# EasyEDA Pro project ProPrj_PCB-rocket-flight-controller_2026-04-01.epro, schematic rocket flight controller

## Sheets
1 Sheet_1: Board Name: rocket flight controller; Create Date: 2025-12-31; Page Name: Sheet_1; Project Name: PCB-rocket-flight-controller; Schematic Name: rocket flight controller; Update Date: 2026-01-02; Add into BOM: yes; Company: Your Company; Convert to PCB: yes; Date: 2025-05-15; Draw By: 2026iruf; REV: 1.0; Sheet: 1/1; spicePre: .
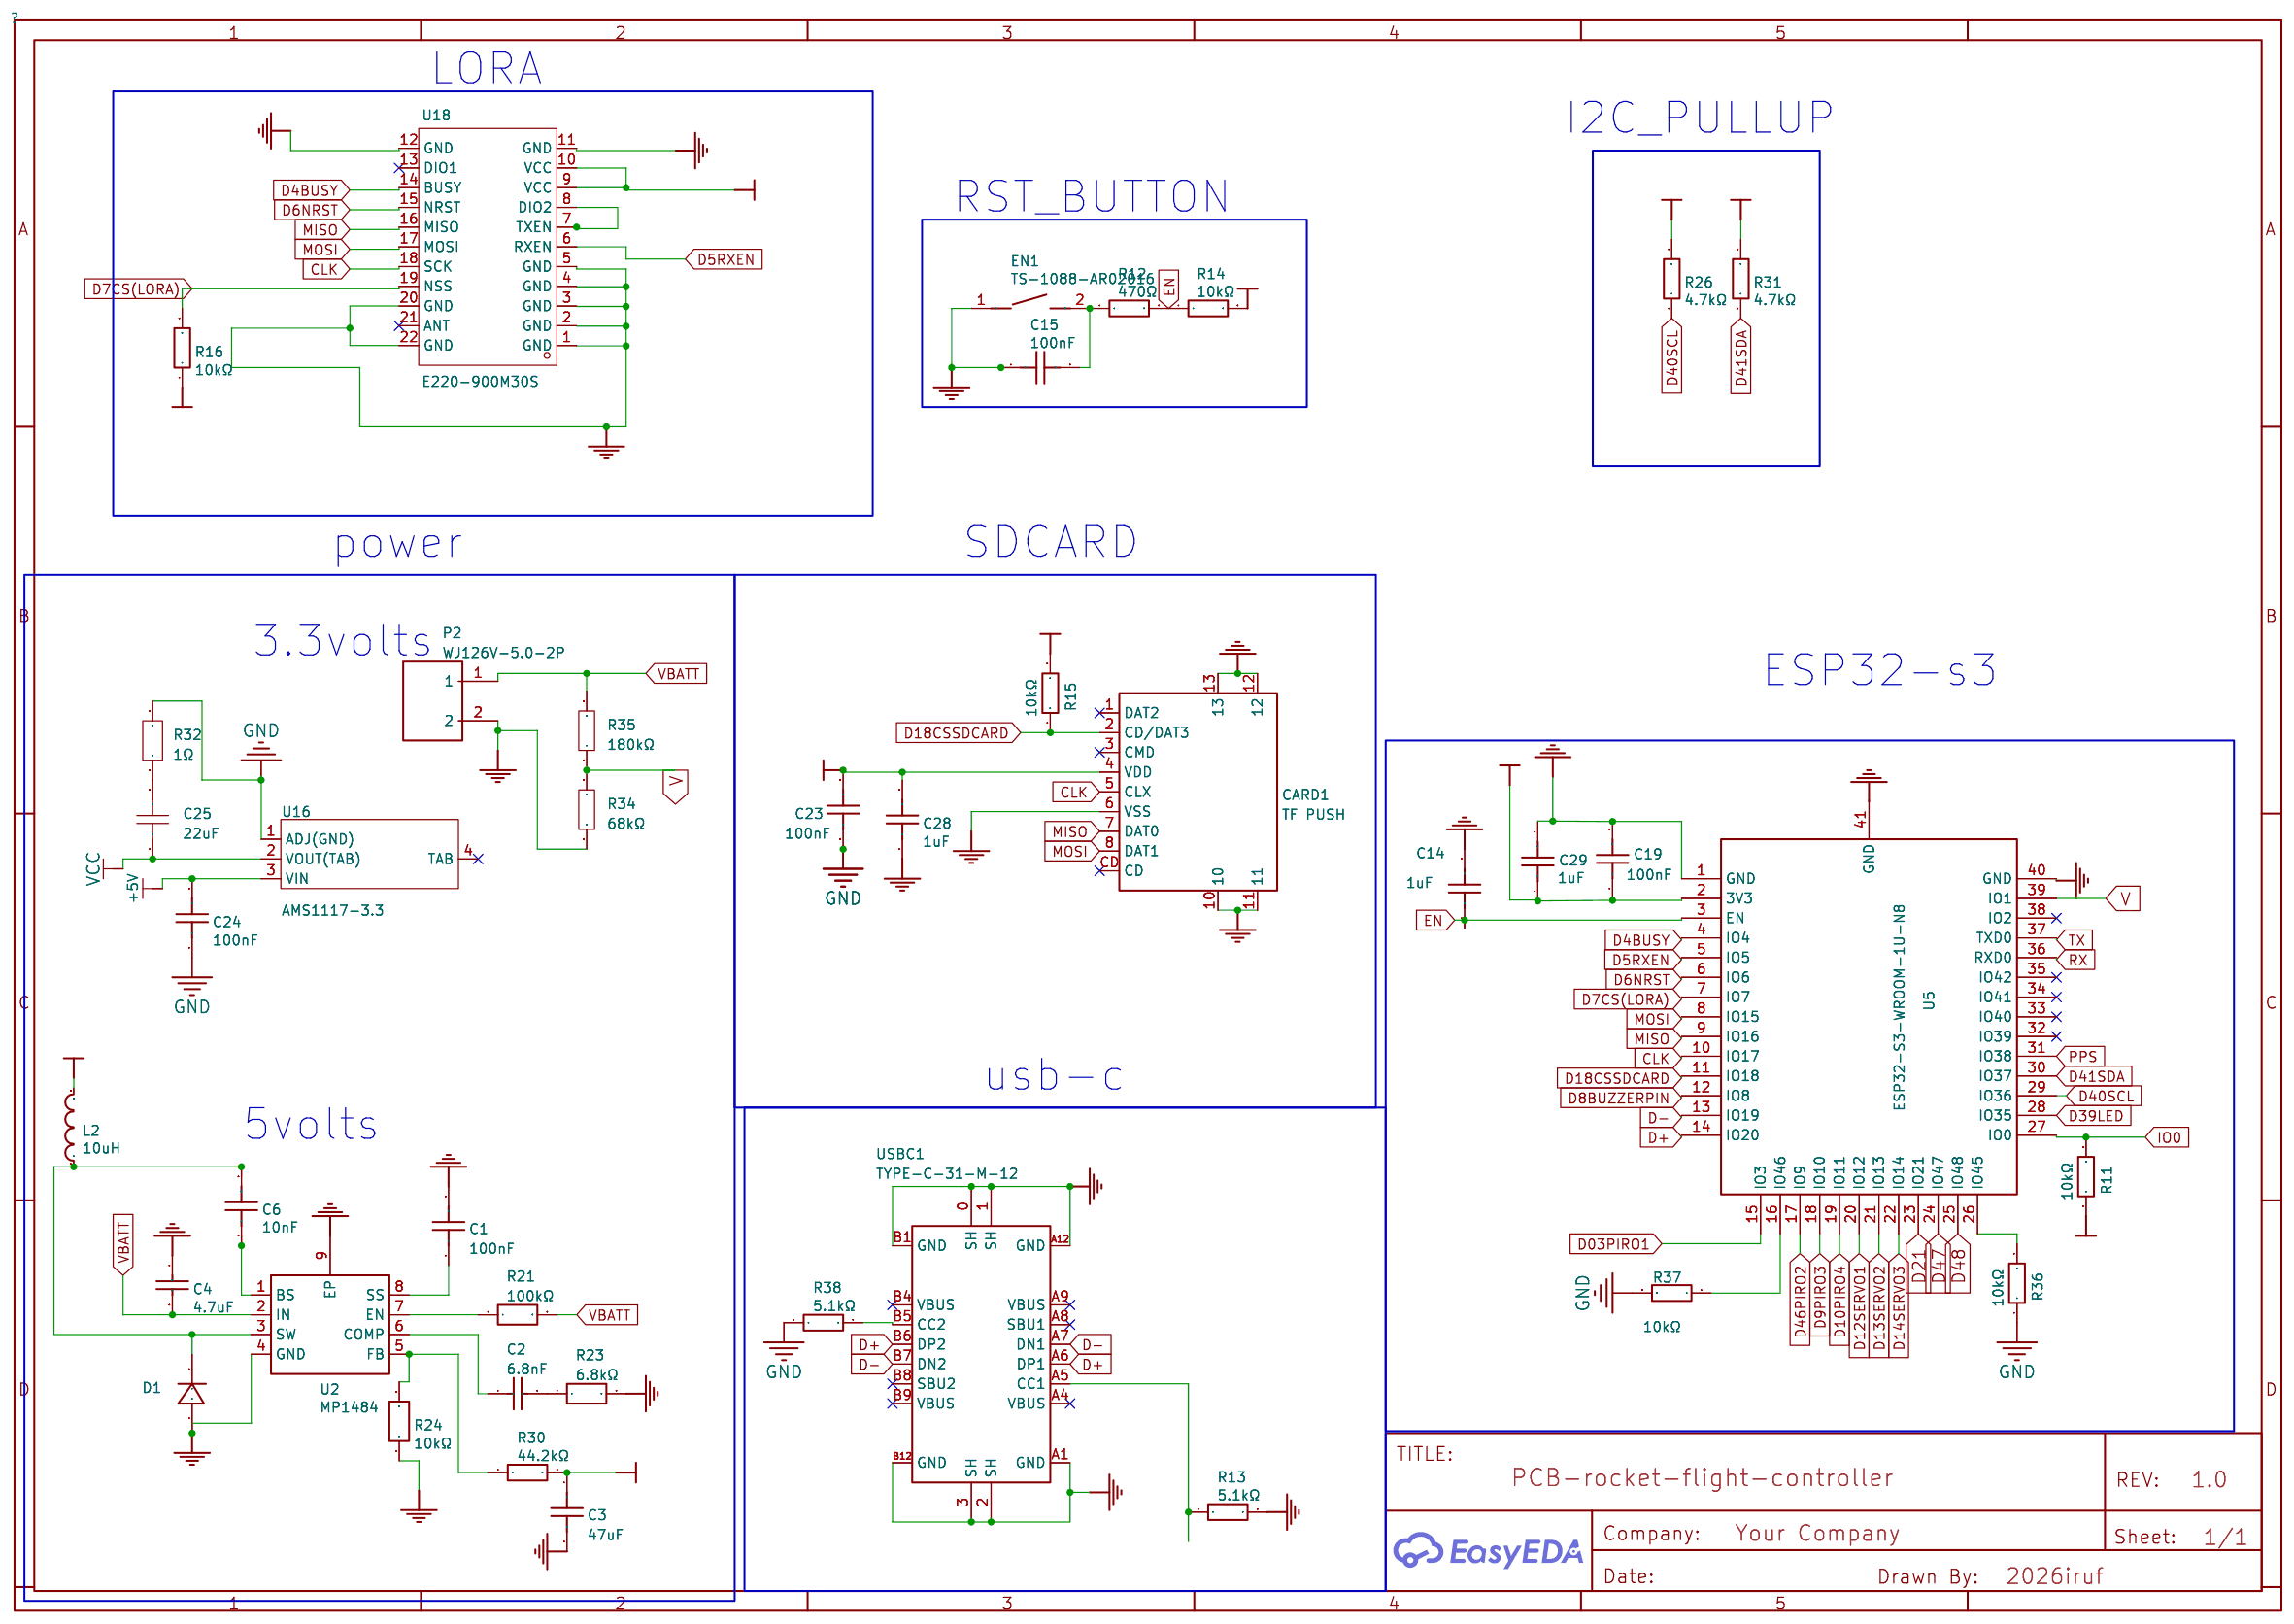
[diagram p0: Sheet_1]
2 Sheet_2: Page Name: Sheet_2; Update Date: 2025-12-31; Date: 2025-05-17; Sheet: 1/2
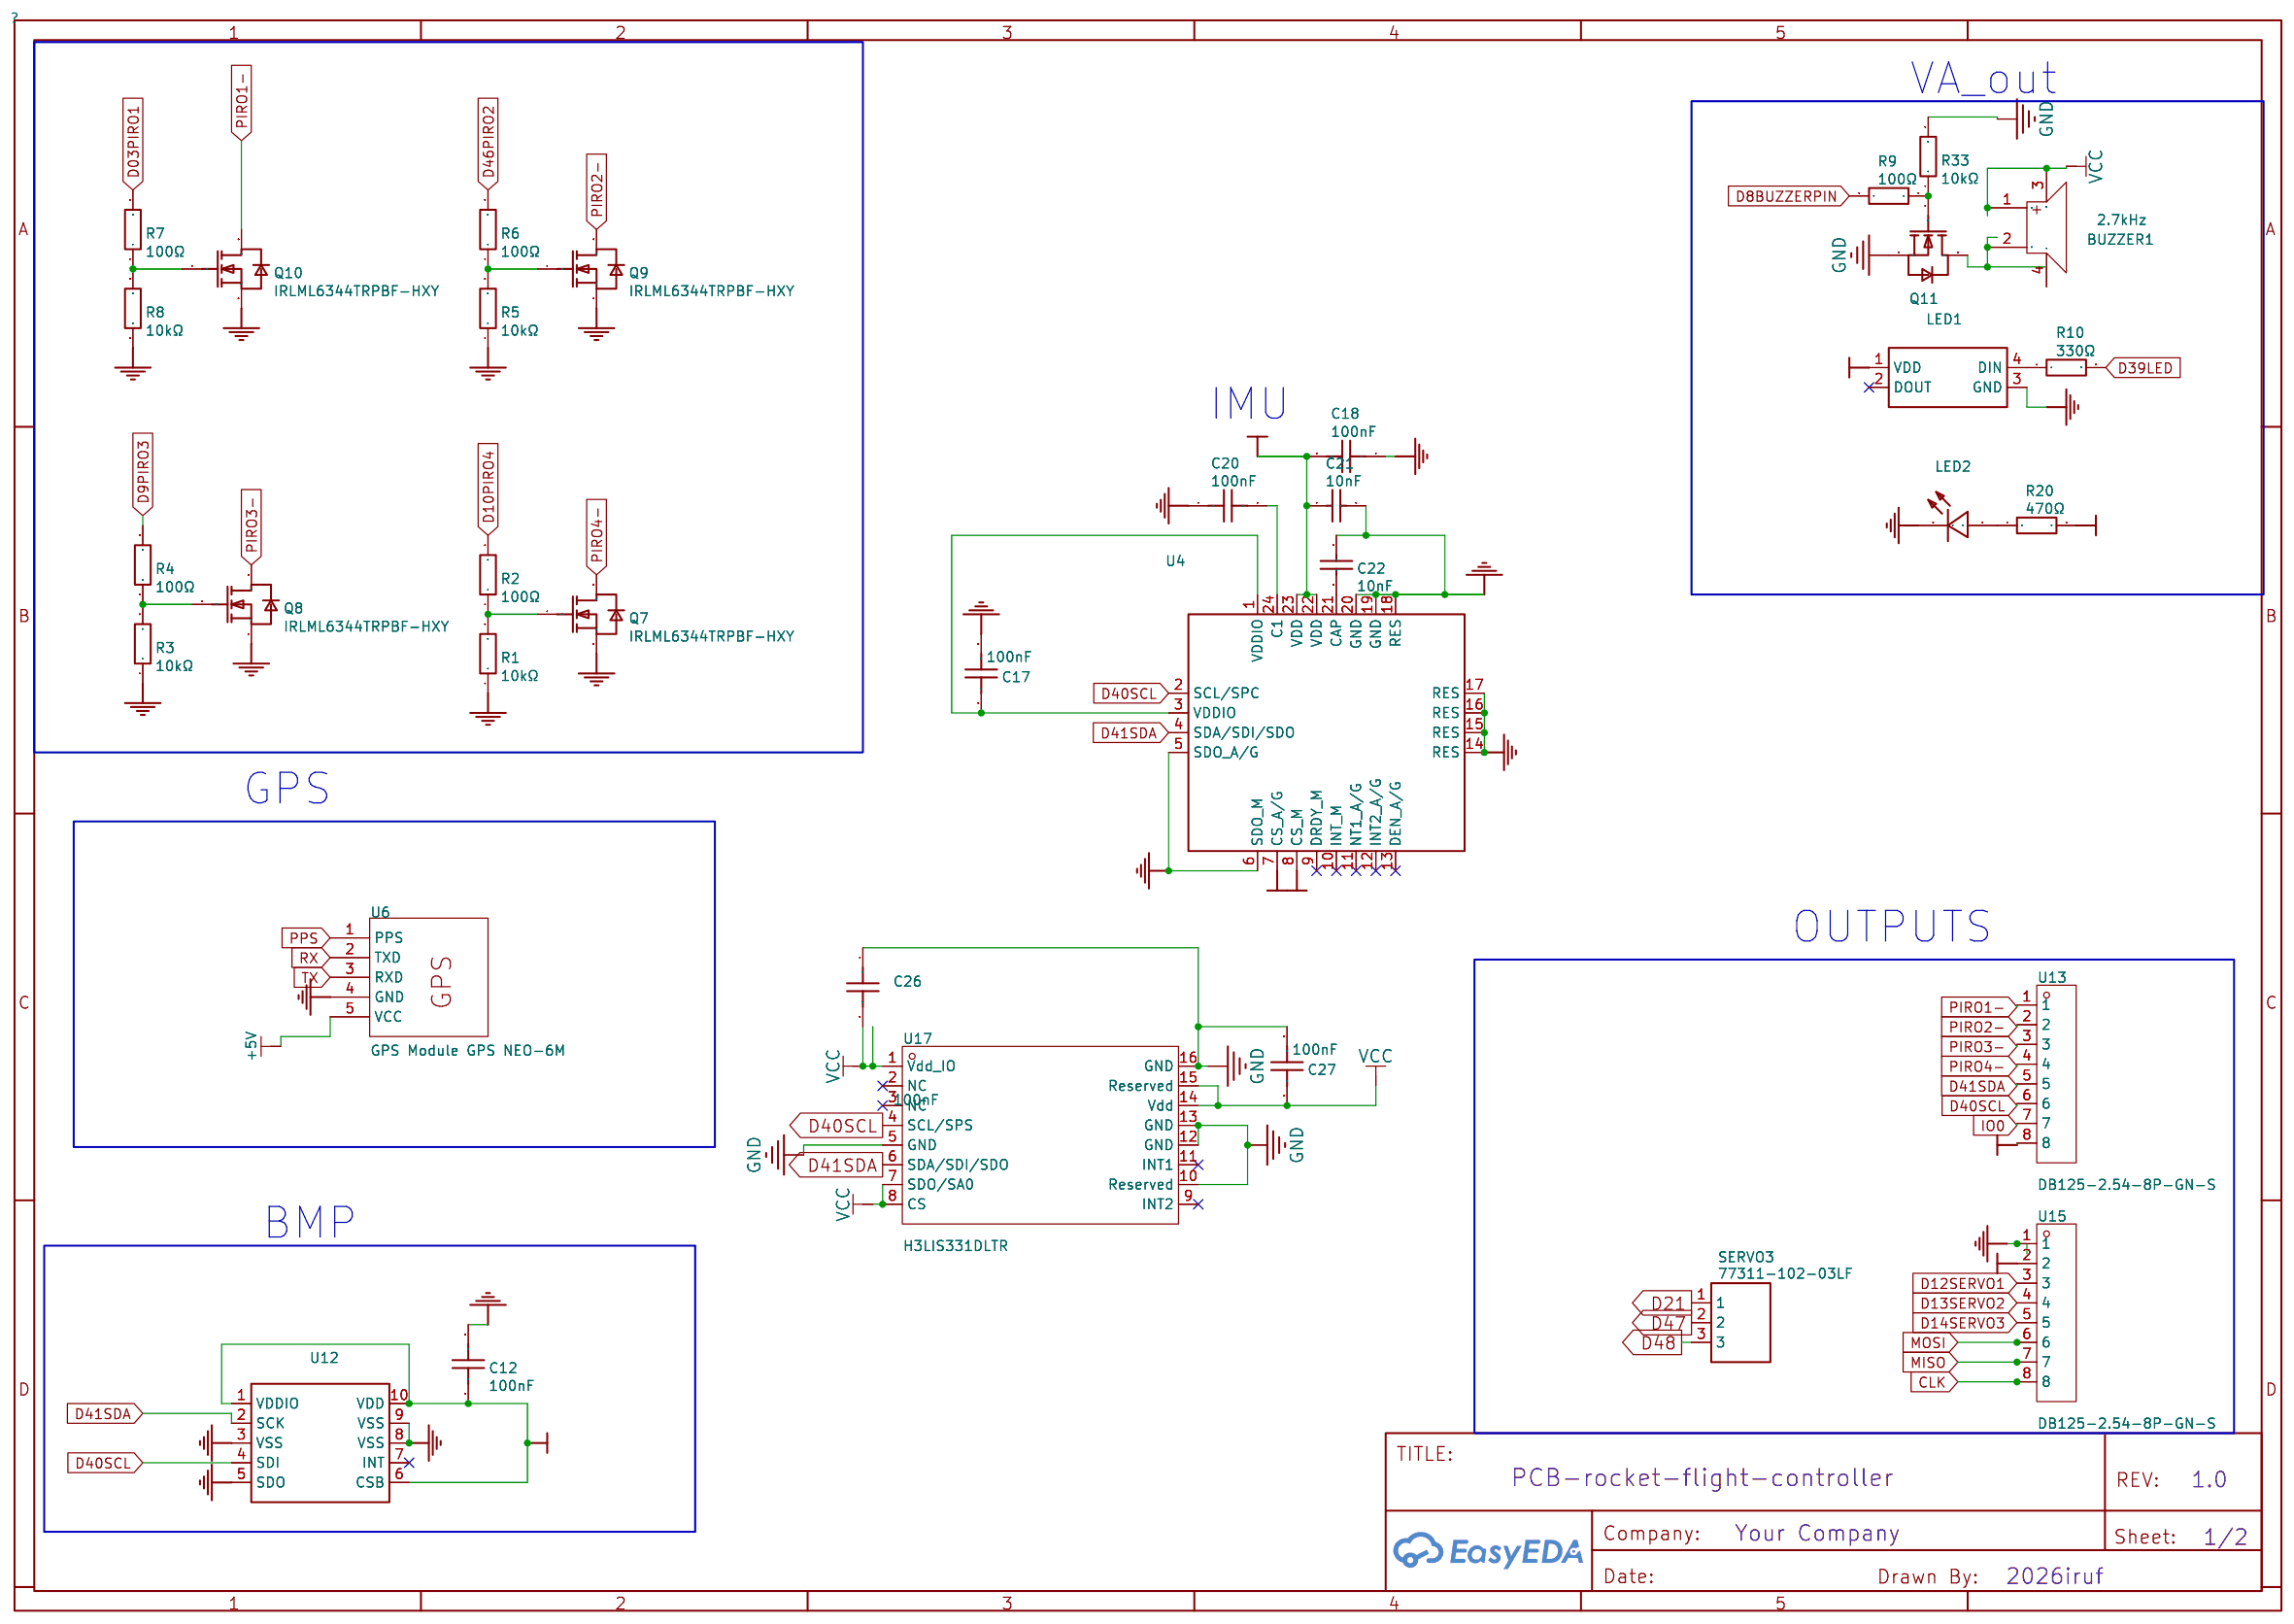
[diagram p1: Sheet_2]

## Parts
sheet Sheet_1
C1  100nF  [C0603]
C2  6.8nF  [C0805]
C3  47uF  [C0805]
C4  4.7uF  [C0805]
C6  10nF  [C0805]
C14  1uF  [C0603]
C15  100nF  [C0603]
C19  100nF  [C0603]
C23  100nF  [C0603]
C24  100nF  [C0603]
C25  22uF  [C0603]
C28  1uF  [C0603]
C29  1uF  [C0603]
CARD1  TF PUSH  [TF-SMD_TF-PUSH]
D1  M7  [SMA_L4.3-W2.6-LS5.2-RD]
EN1  TS-1088-AR02016  [SW-SMD_L3.9-W3.0-P4.45]
L2  10uH  [IND-SMD_L7.3-W6.6]
P2  WJ126V-5.0-2P  [CONN-TH_WJ126V-5.0-2P]
R11  10kΩ  [R0603]
R12  470Ω  [R0603]
R13  5.1kΩ  [R0603]
R14  10kΩ  [R0603]
R15  10kΩ  [R0603]
R16  10kΩ  [R0603]
R21  100kΩ  [R0603]
R23  6.8kΩ  [R0603]
R24  10kΩ  [R0603]
R26  4.7kΩ  [R0603]
R30  44.2kΩ  [R0603]
R31  4.7kΩ  [R0603]
R32  1Ω  [R0603]
R34  68kΩ  [R0603]
R35  180kΩ  [R0603]
R36  10kΩ  [R0603]
R37  10kΩ  [R0603]
R38  5.1kΩ  [R0603]
U2  MP1484  [SOP-8_L4.9-W3.9-P1.27-LS6.0-BL-EP3.1]
U5  ESP32-S3-WROOM-1U-N8  [WIRELM-SMD_ESP32-S3-WROOM-1U]
U16  AMS1117-3.3  [SOT-223-4_L6.5-W3.5-P2.30-LS7.0-BR]
U18  E220-900M30S  [WIRELM-SMD_E22-900M30S]
USBC1  TYPE-C-31-M-12  [USB-C_SMD-TYPE-C-31-M-12]
sheet Sheet_2
BUZZER1  2.7kHz  [BUZ-SMD_4P-L7.5-W7.5-BR]
C12  100nF  [C0603]
C17  100nF  [C0603]
C18  100nF  [C0603]
C20  100nF  [C0603]
C21  10nF  [C0603]
C22  10nF  [C0603]
C26  100nF  [C0603]
C27  100nF  [C0603]
LED1  SK6812MINI-E  [LED-SMD_L3.2-W2.8-LS5.9_SK6812MINI-E]
LED2  NCD0805G1  [LED0805-R-RD]
Q7  IRLML6344TRPBF-HXY  [SOT-23-3_L2.9-W1.3-P1.90-LS2.4-BR-1]
Q8  IRLML6344TRPBF-HXY  [SOT-23-3_L2.9-W1.3-P1.90-LS2.4-BR-1]
Q9  IRLML6344TRPBF-HXY  [SOT-23-3_L2.9-W1.3-P1.90-LS2.4-BR-1]
Q10  IRLML6344TRPBF-HXY  [SOT-23-3_L2.9-W1.3-P1.90-LS2.4-BR-1]
Q11  IRLML6344TRPBF-HXY  [SOT-23-3_L2.9-W1.3-P1.90-LS2.4-BR-1]
R1  10kΩ  [R0603]
R2  100Ω  [R0603]
R3  10kΩ  [R0603]
R4  100Ω  [R0603]
R5  10kΩ  [R0603]
R6  100Ω  [R0603]
R7  100Ω  [R0603]
R8  10kΩ  [R0603]
R9  100Ω  [R0603]
R10  330Ω  [R0805]
R20  470Ω  [R0603]
R33  10kΩ  [R0603]
SERVO3  77311-102-03LF  [HDR-TH_3P-P2.54-V-M-1]
U4  LSM9DS1TR  [LGA-24_L3.5-W3.0-P0.43-TL]
U6  GPS Module GPS NEO-6M  [GPS MODULE GPS NEO-6M]
U12  BMP581  [LGA-10_L2.0-W2.0-P0.50-TL_BMP581]
U13  DB125-2.54-8P-GN-S  [CONN-TH_DB125-2.54-8P-GN]
U15  DB125-2.54-8P-GN-S  [CONN-TH_DB125-2.54-8P-GN]
U17  H3LIS331DLTR  [LGA-16_L3.0-W3.0-P0.50-BL]

## Library data of the parts
C1 C12 C15 C17-C20 C23 C24 C26 C27 = 100nF: Supplier: LCSC; Manufacturer: YAGEO(国巨); Manufacturer Part: CC0603KRX7R9BB104; Supplier Part: C14663; JLCPCB Part Class: Basic Part; nameAlias: Value; spicePre: C; spiceSymbolName: CC0603KRX7R9BB104; Check: true
C2 = 6.8nF: Supplier: LCSC; Manufacturer Part: GRM2195C1H682JA01D; Manufacturer: muRata(村田); Supplier Part: C77068; JLCPCB Part Class: Extended Part; nameAlias: Value; spicePre: C; spiceSymbolName: GRM2195C1H682JA01D; Check: true
C3 = 47uF: Supplier: LCSC; Supplier Part: C6119904; Manufacturer: HRE(芯声); Manufacturer Part: CGA0805X5R476M100MT; JLCPCB Part Class: Extended Part; nameAlias: Value; Contributor: lcsc; spicePre: C; spiceSymbolName: CGA0805X5R476M100MT; Check: true
C4 = 4.7uF: Supplier: LCSC; Manufacturer Part: CL21A475KAQNNNE; Manufacturer: SAMSUNG(三星); Supplier Part: C1779; JLCPCB Part Class: Basic Part; nameAlias: Value; spicePre: C; spiceSymbolName: CL21A475KAQNNNE; Check: true
C6 = 10nF: Supplier: LCSC; Manufacturer Part: CC0805KRX7R9BB103; Manufacturer: YAGEO(国巨); Supplier Part: C83170; JLCPCB Part Class: Extended Part; nameAlias: Value; spicePre: C; spiceSymbolName: CC0805KRX7R9BB103; Check: true
C14 C28 C29 = 1uF: Supplier: LCSC; Manufacturer Part: CL10A105KB8NNNC; Manufacturer: SAMSUNG(三星); Supplier Part: C15849; JLCPCB Part Class: Basic Part; nameAlias: Value; spicePre: C; spiceSymbolName: CL10A105KB8NNNC; Check: true
C25 = CL10A226MP8NUNE: Capacitance:22uF Tolerance:±20% Tolerance:±20% Voltage Rating:10V Temperature Coefficient:X5R; LCSC Part Name: 22uF ±20% 10V; Supplier Part: C86295; Manufacturer: SAMSUNG(三星); Supplier Footprint: 0603; JLCPCB Part Class: Extended Part; Datasheet: https://item.szlcsc.com/datasheet/CL10A226MP8NUNE/87471.html; Supplier: LCSC; Tolerance: ±20%; Voltage Rating: 10V; Temperature Coefficient: X5R; Check: true
CARD1 = TF PUSH: Supplier: LCSC; Supplier Part: C393941; Manufacturer: SHOU HAN(首韩); JLCPCB Part Class: Extended Part; Contributor: LCSC; spicePre: C; Check: true
D1 = M7_C95872: Diode Configuration:Independent Voltage - Forward(Vf@If):1.1V@1A Voltage - DC Reverse(Vr):1kV Current - Rectified:1A Reverse Leakage Current (Ir):5uA@1kV Non-Repetitive Peak Forward Surge Current:30A Operating Junction Temperature Range:-55℃~+150℃ Operati; Supplier Part: C95872; Manufacturer: MDD(辰达半导体); Supplier Footprint: SMA(DO-214AC); JLCPCB Part Class: Basic Part; Datasheet: https://item.szlcsc.com/datasheet/M7/97076.html; Supplier: LCSC; Diode Configuration: Independent; Voltage - Forward(Vf@If): 1.1V@1A; Voltage - DC Reverse(Vr): 1kV; Current - Rectified: 1A; Reverse Leakage Current (Ir): 5uA@1kV; Non-Repetitive Peak Forward Surge Current: 30A; Operating Junction Temperature Range: -55℃~+150℃; Check: true
EN1 = TS-1088-AR02016: Supplier: LCSC; Supplier Part: C720477; Manufacturer: XUNPU(讯普); JLCPCB Part Class: Extended Part; Contributor: LCSC; spicePre: S; Check: true
L2 = 10uH: Supplier: LCSC; Manufacturer: SXN(顺翔诺); Manufacturer Part: SMMS0630-100M; Supplier Part: C128692; JLCPCB Part Class: Extended Part; nameAlias: Value; spicePre: L; spiceSymbolName: SMMS0630-100M; Check: true
P2 = WJ126V-5.0-2P: Supplier: LCSC; Manufacturer: KANGNEX(康奈克斯电气); Supplier Part: C8404; JLCPCB Part Class: Extended Part; spicePre: P; Check: true
R1 R3 R5 R8 R11 R14-R16 R33 R36 R37 = 10kΩ: Supplier: LCSC; Manufacturer: YAGEO(国巨); Manufacturer Part: RC0603FR-0710KL; Supplier Part: C98220; JLCPCB Part Class: Extended Part; nameAlias: Value; spicePre: R; spiceSymbolName: RC0603FR-0710KL; Check: true
R12 R20 = 470Ω: Supplier: LCSC; Manufacturer: YAGEO(国巨); Manufacturer Part: RC0603FR-07470RL; Supplier Part: C114669; JLCPCB Part Class: Extended Part; nameAlias: Value; spicePre: R; spiceSymbolName: RC0603FR-07470RL; Check: true
R13 R38 = 5.1kΩ: Supplier: LCSC; Manufacturer: YAGEO(国巨); Manufacturer Part: RC0603FR-075K1L; Supplier Part: C105580; JLCPCB Part Class: Extended Part; nameAlias: Value; spicePre: R; spiceSymbolName: RC0603FR-075K1L; Check: true
R21 = FRC0603J104 TS: Type:Thick Film Resistor Resistance:100kΩ Tolerance:±5% Tolerance:±5% Power(Watts):100mW Voltage-Supply(Max):75V Temperature Coefficient:±100ppm/℃ Temperature Coefficient:±100ppm/℃ Operating Temperature:-55℃~+155℃ Operating Temperature:-55℃~+155℃; LCSC Part Name: 100kΩ ±5% 100mW 厚膜电阻; Supplier Part: C2907088; Manufacturer: FOJAN(富捷); Supplier Footprint: 0603; JLCPCB Part Class: Extended Part; Datasheet: https://item.szlcsc.com/datasheet/FRC0603J104%2520TS/3180601.html; Supplier: LCSC; Type: Thick Film Resistor; Tolerance: ±5%; Power(Watts): 100mW; Voltage-Supply(Max): 75V; Temperature Coefficient: ±100ppm/℃; Operating Temperature: -55℃~+155℃; Check: true
R23 = RC0603FR-076K8L: Type:Thick Film Resistor Resistance:6.8kΩ Tolerance:±1% Tolerance:±1% Power(Watts):100mW Voltage-Supply(Max):75V Temperature Coefficient:±100ppm/℃ Temperature Coefficient:±100ppm/℃ Operating Temperature:-55℃~+155℃ Operating Temperature:-55℃~+155℃; LCSC Part Name: 厚膜电阻 6.8kΩ ±1% 100mW; Supplier Part: C114632; Manufacturer: YAGEO(国巨); Supplier Footprint: 0603; JLCPCB Part Class: Extended Part; Datasheet: https://item.szlcsc.com/datasheet/RC0603FR-076K8L/115876.html; Supplier: LCSC; Type: Thick Film Resistor; Tolerance: ±1%; Power(Watts): 100mW; Voltage-Supply(Max): 75V; Temperature Coefficient: ±100ppm/℃; Operating Temperature: -55℃~+155℃; Check: true
R24 = RC0603FR-0710KL: Type:Thick Film Resistors Resistance: Tolerance:±1% Tolerance:±1% Power(Watts): Overload Voltage (Max): Temperature Coefficient:±100ppm/℃ Temperature Coefficient:±100ppm/℃ Operating Temperature Range:-55℃~+155℃ Operating Temperature Range:-55℃~+155℃; LCSC Part Name: 厚膜电阻 10kΩ ±1% 100mW; Supplier Part: C98220; Manufacturer: YAGEO(国巨); Supplier Footprint: 0603; JLCPCB Part Class: Extended Part; Datasheet: https://atta.szlcsc.com/upload/public/pdf/source/20180927/C295883_E8D83085EA81BD7DE0B2B681138C15EE.pdf; Supplier: LCSC; Type: Thick Film Resistors; Tolerance: ±1%; Temperature Coefficient: ±100ppm/℃; Operating Temperature Range: -55℃~+155℃; Check: true
R26 R31 = 4.7kΩ: Supplier: LCSC; Manufacturer: YAGEO(国巨); Manufacturer Part: RC0603FR-074K7L; Supplier Part: C99782; JLCPCB Part Class: Extended Part; nameAlias: Value; spicePre: R; spiceSymbolName: RC0603FR-074K7L; Check: true
R30 = 44.2kΩ: Supplier: LCSC; Manufacturer: UNI-ROYAL(厚声); Manufacturer Part: 0603WAF4422T5E; Supplier Part: C23056; JLCPCB Part Class: Extended Part; nameAlias: Value; spicePre: R; spiceSymbolName: 0603WAF4422T5E; Check: true
R32 = FRC0603J1R0 TS: Type:Thick Film Resistor Resistance:1Ω Tolerance:±5% Tolerance:±5% Power(Watts):100mW Voltage-Supply(Max):75V Temperature Coefficient:±200ppm/℃ Temperature Coefficient:±200ppm/℃ Operating Temperature:-55℃~+155℃ Operating Temperature:-55℃~+155℃; LCSC Part Name: 1Ω ±5% 100mW 厚膜电阻; Supplier Part: C2907116; Manufacturer: FOJAN(富捷); Supplier Footprint: 0603; JLCPCB Part Class: Extended Part; Supplier: LCSC; Type: Thick Film Resistor; Tolerance: ±5%; Power(Watts): 100mW; Voltage-Supply(Max): 75V; Temperature Coefficient: ±200ppm/℃; Operating Temperature: -55℃~+155℃; Check: true
R34 = RC0603FR-0768KL: Type:Thick Film Resistor Resistance:68kΩ Tolerance:±1% Tolerance:±1% Power(Watts):100mW Voltage-Supply(Max):75V Temperature Coefficient:±100ppm/℃ Temperature Coefficient:±100ppm/℃ Operating Temperature:-55℃~+155℃ Operating Temperature:-55℃~+155℃; LCSC Part Name: 厚膜电阻 68kΩ ±1% 100mW; Supplier Part: C114633; Manufacturer: YAGEO(国巨); Supplier Footprint: 0603; JLCPCB Part Class: Extended Part; Datasheet: https://item.szlcsc.com/datasheet/RC0603FR-0768KL/115877.html; Supplier: LCSC; Type: Thick Film Resistor; Tolerance: ±1%; Power(Watts): 100mW; Voltage-Supply(Max): 75V; Temperature Coefficient: ±100ppm/℃; Operating Temperature: -55℃~+155℃
R35 = RC0603FR-07180KL: Type:Thick Film Resistors Resistance: Tolerance:±1% Tolerance:±1% Power(Watts): Overload Voltage (Max): Temperature Coefficient:±100ppm/℃ Temperature Coefficient:±100ppm/℃ Operating Temperature Range:-55℃~+155℃ Operating Temperature Range:-55℃~+155℃; LCSC Part Name: 厚膜电阻 180kΩ ±1% 100mW; Supplier Part: C123419; Manufacturer: YAGEO(国巨); Supplier Footprint: 0603; JLCPCB Part Class: Extended Part; Datasheet: https://atta.szlcsc.com/upload/public/pdf/source/20180821/C275644_0D56F95EFF785E7D9A1FEF436B37DA78.pdf; Supplier: LCSC; Type: Thick Film Resistors; Tolerance: ±1%; Temperature Coefficient: ±100ppm/℃; Operating Temperature Range: -55℃~+155℃
U2 = MP1484: Supplier: LCSC; Supplier Part: C917144; Manufacturer: JSMSEMI(杰盛微); JLCPCB Part Class: Extended Part; Contributor: lcsc; spicePre: U; Check: true
U5 = ESP32-S3-WROOM-1U-N8: Supplier: LCSC; Supplier Part: C2980297; Manufacturer: ESPRESSIF(乐鑫); JLCPCB Part Class: Extended Part; Contributor: LCSC; spicePre: U; Check: true
U16 = AMS1117-3.3_C347222: Output Type:Fixed Voltage - Supply:12V Output Voltage:3.3V Output Voltage:3.3V Output Current:1A Power Supply Rejection Ratio (PSRR):60dB@(120Hz) Voltage Dropout:1.3V@(1A) standby current:- Noise:- Features:Overcurrent Protection Operating Temperature:- O; LCSC Part Name: 输出:3.3V 电流:1A 耐压:12V; Supplier Part: C347222; Manufacturer: UMW(友台半导体); Supplier Footprint: SOT-223; JLCPCB Part Class: Extended Part; Datasheet: https://item.szlcsc.com/datasheet/AMS1117-3.3/323882.html; Supplier: LCSC; Output Type: Fixed; Voltage - Supply: 12V; Output Voltage: 3.3V; Output Current: 1A; Power Supply Rejection Ratio (PSRR): 60dB@(120Hz); Voltage Dropout: 1.3V@(1A); Features: Overcurrent Protection; Output Configuration: Positive electrode; Number of Outputs: 1; Check: true
U18 = E220-900M30S: Output Power:30.5dBm Output Power:30.5dBm Interface Type:SPI Modulation System:LoRa Voltage - Supply:3V~5.5V Voltage - Supply:3V~5.5V Antenna Type:Stamp Hole Antenna；IPEX Connector Receive  Current:14mA Send  Current:700mA Sensitivity:-129dBm Sensitivity:; LCSC Part Name: 新LoRa扩频无线模块进口LLCC68+PA+LNA低功耗433M小体积双天线IPX; Supplier Part: C2965511; Manufacturer: EBYTE(亿佰特); Supplier Footprint: SMD,38.5x24mm; JLCPCB Part Class: Extended Part; Datasheet: https://item.szlcsc.com/datasheet/E220-900M30S/3357272.html; Supplier: LCSC; Output Power: 30.5dBm; Interface Type: SPI; Modulation System: LoRa; Voltage - Supply: 3V~5.5V; Antenna Type: Stamp Hole Antenna；IPEX Connector; Receive  Current: 14mA; Send  Current: 700mA; Sensitivity: -129dBm; Communication Distance: 10km
USBC1 = TYPE-C-31-M-12: Supplier: LCSC; Supplier Part: C165948; Manufacturer: 韩国韩荣; JLCPCB Part Class: Extended Part; Contributor: LCSC; spicePre: U; Check: true
BUZZER1 = SMD7525-16Ω: Driver Circuitry:Passive (Externally Driven) Technology:Electromagnetic Voltage Rating:3.6V Voltage - Supply:2.5V~4.5V Voltage - Supply:2.5V~4.5V Frequency:2.7kHz Current Consumption:100mA Sound Pressure Level(SPL):80dB Length:7.5mm Width:7.5mm Height:2.5; LCSC Part Name: 蜂鸣器; Supplier Part: C49246950; Manufacturer: XHXDZ(兴华鑫); Supplier Footprint: SMD,7.5x7.5mm; JLCPCB Part Class: Extended Part; Datasheet: https://item.szlcsc.com/datasheet/SMD7525-16%25CE%25A9/51674919.html; Supplier: LCSC; Driver Circuitry: Passive (Externally Driven); Technology: Electromagnetic; Voltage Rating: 3.6V; Voltage - Supply: 2.5V~4.5V; Current Consumption: 100mA; Sound Pressure Level(SPL): 80dB; Length: 7.5mm; Width: 7.5mm; Height: 2.5mm; Check: true
C21 C22 = 10nF: Supplier: LCSC; Manufacturer Part: CL10B103KB8NNNC; Manufacturer: SAMSUNG(三星); Supplier Part: C1589; JLCPCB Part Class: Extended Part; nameAlias: Value; spicePre: C; spiceSymbolName: CL10B103KB8NNNC; Check: true
LED1 = SK6812MINI-E_C5149201: Supplier Part: C5149201; Manufacturer: 欧思科光电; Supplier Footprint: SMD; JLCPCB Part Class: Extended Part; Datasheet: https://item.szlcsc.com/datasheet/SK6812MINI-E/5773397.html; Supplier: LCSC; Check: true
LED2 = NCD0805G1: Lamp Holder Type:- Illumination Color:Green Voltage - Forward(Vf):2.5V~3.6V Voltage - Forward(Vf):2.5V~3.6V Power(Watts):72mW Forward Current:20mA Wavelength - Dominant:525nm~537.5nm Wavelength - Dominant:525nm~537.5nm Peak Wavelength:520nm Diode Configur; LCSC Part Name: 片式发光二极管; Supplier Part: C84260; Manufacturer: 国星光电; Supplier Footprint: 0805; JLCPCB Part Class: Extended Part; Datasheet: https://item.szlcsc.com/datasheet/NCD0805G1/85429.html; Supplier: LCSC; Illumination Color: Green; Voltage - Forward(Vf): 2.5V~3.6V; Power(Watts): 72mW; Forward Current: 20mA; Wavelength - Dominant: 525nm~537.5nm; Peak Wavelength: 520nm; Luminous Intensity: 400mcd; Viewing Angle: 130°; Operating Temperature: -30℃~+85℃; Check: true
Q7-Q11 = IRLML6344TRPBF-HXY: Supplier: LCSC; Supplier Part: C6285738; Manufacturer: HXY MOSFET(华轩阳电子); JLCPCB Part Class: Extended Part; Contributor: lcsc; spicePre: Q; Check: true
R2 R4 R6 R7 R9 = 100Ω: Supplier: LCSC; Manufacturer: YAGEO(国巨); Manufacturer Part: RC0603FR-07100RL; Supplier Part: C105588; JLCPCB Part Class: Extended Part; nameAlias: Value; spicePre: R; spiceSymbolName: RC0603FR-07100RL; Check: true
R10 = 330Ω: Supplier: LCSC; Manufacturer: UNI-ROYAL(厚声); Manufacturer Part: 0805W8F3300T5E; Supplier Part: C17630; JLCPCB Part Class: Basic Part; nameAlias: Value; spicePre: R; spiceSymbolName: 0805W8F3300T5E; Check: true
SERVO3 = 77311-102-03LF: Supplier: LCSC; Supplier Part: C180248; Manufacturer: Amphenol; JLCPCB Part Class: Extended Part; Contributor: LCSC; spicePre: H; Check: true
U4 = LSM9DS1TR: Supplier: LCSC; Supplier Part: C2655096; Manufacturer: ST(意法半导体); JLCPCB Part Class: Extended Part; Contributor: LCSC; spicePre: U; Check: true
U6 = GPS Module GPS NEO-6M: Contributor: kien.vupham; spicePre: U; spiceSymbolName: ATGM336H GPS MODULE; Check: true
U12 = BMP581: Supplier: LCSC; Supplier Part: C5362283; Manufacturer: Bosch(博世); JLCPCB Part Class: Extended Part; Contributor: lcsc; spicePre: U; Check: true
U13 U15 = DB125-2.54-8P-GN-S: Number of Positions or Pins:1x8P Pitch:2.54mm Color:Green Mounting Type:Through Hole Number of Pins:8P Number of Rows:1 Number of PINs Per Row:8 Current Rating:7A Voltage Rating (Max):150V Wire Gauge - AWG:18~26 Wire Gauge - AWG:18~26 Wire Gauge - mm2:1 W; LCSC Part Name: 1x8P 2.54mm 直插 排数:1 每排P数:8; Supplier Part: C918126; Manufacturer: DORABO(地博电气); Supplier Footprint: 插件,P=2.54mm; JLCPCB Part Class: Extended Part; Datasheet: https://atta.szlcsc.com/upload/public/pdf/source/20230106/BCD3A0BE1EB95DC3E813F1745F022035.pdf; Supplier: LCSC; Number of Positions or Pins: 1x8P; Pitch: 2.54mm; Color: Green; Mounting Type: Through Hole; Number of Pins: 8P; Number of Rows: 1; Number of PINs Per Row: 8; Current Rating: 7A; Voltage Rating (Max): 150V; Wire Gauge - AWG: 18~26; Wire Gauge - mm2: 1; Operating Temperature: -40℃~+105℃; Check: true
U17 = H3LIS331DLTR: Voltage - Supply:2.16V~3.6V Voltage - Supply:2.16V~3.6V Operating Temperature:-40℃~+85℃ Operating Temperature:-40℃~+85℃; Supplier Part: C2655074; Manufacturer: ST(意法半导体); Supplier Footprint: TFLGA-16(3x3); JLCPCB Part Class: Extended Part; Datasheet: https://item.szlcsc.com/datasheet/H3LIS331DLTR/2746983.html; Supplier: LCSC; Voltage - Supply: 2.16V~3.6V; Operating Temperature: -40℃~+85℃; Check: true

## Nets
+5V: C3.1 C24.2 L2.2 LED1.1(VDD) R30.2 U6.5(VCC) U15.2 U16.3(VIN) U18.9(VCC) U18.10(VCC)
GND: C1.2 C3.2 C4.1 C12.2 C14.2 C15.1 C17.2 C18.1 C19.2 C20.1 C21.2 C22.2 C23.1 C24.1 C26.1 C27.2 C28.1 C29.2 CARD1.6(VSS) CARD1.10 CARD1.11 CARD1.12 CARD1.13 D1.2(A) EN1.1 LED1.3(GND) LED2.2(K) P2.2 Q7.2(S) Q8.2(S) Q9.2(S) Q10.2(S) Q11.2(S) R1.1 R3.1 R5.1 R8.1 R13.2 R23.2 R24.1 R32.2 R33.2 R34.1 R36.1 R37.2 R38.1 U2.4(GND) U2.9(EP) U4.5(SDO_A/G) U4.6(SDO_M) U4.14(RES) U4.15(RES) U4.16(RES) U4.17(RES) U4.18(RES) U4.19(GND) U4.20(GND) U5.1(GND) U5.40(GND) U5.41(GND) U6.4(GND) U12.3(VSS) U12.5(SDO) U12.8(VSS) U12.9(VSS) U15.1 U16.1(ADJ(GND)) U17.5(GND) U17.10(Reserved) U17.12(GND) U17.13(GND) U17.16(GND) U18.5(GND) U18.11(GND) U18.12(GND) U18.20(GND) U18.22(GND) USBC1.0(SH) USBC1.1(SH) USBC1.2(SH) USBC1.3(SH) USBC1.A1(GND) USBC1.A12(GND) USBC1.B1(GND) USBC1.B12(GND)
VBATT: C4.2 P2.1 R21.2 R35.2 U2.2(IN)
VCC: BUZZER1.1 BUZZER1.3 C12.1 C18.2 C19.1 C21.1 C23.2 C25.1 C26.2 C27.1 C28.2 C29.1 CARD1.4(VDD) R11.1 R14.2 R15.2 R16.1 R20.2 R26.2 R31.2 U4.7(CS_A/G) U4.8(CS_M) U4.22(VDD) U4.23(VDD) U5.2(3V3) U12.1(VDDIO) U12.6(CSB) U12.10(VDD) U13.8 U16.2(VOUT(TAB)) U17.1(Vdd_IO) U17.7(SDO/SA0) U17.8(CS) U17.14(Vdd) U17.15(Reserved)
CLK: CARD1.5(CLX) U5.10(IO17) U15.8 U18.18(SCK)
D03PIRO1: R7.2 U5.15(IO3)
D4BUSY: U5.4(IO4) U18.14(BUSY)
D5RXEN: U5.5(IO5) U18.6(RXEN)
D6NRST: U5.6(IO6) U18.15(NRST)
D7CS(LORA): R16.2 U5.7(IO7) U18.19(NSS)
D8BUZZERPIN: R9.2 U5.12(IO8)
D9PIRO3: R4.2 U5.18(IO10)
D10PIRO4: R2.2 U5.19(IO11)
D12SERVO1: U5.20(IO12) U15.3
D13SERVO2: U5.21(IO13) U15.4
D14SERVO3: U5.22(IO14) U15.5
D18CSSDCARD: CARD1.2(CD/DAT3) R15.1 U5.11(IO18)
D21: SERVO3.1 U5.23(IO21)
D39LED: R10.2 U5.28(IO35)
D40SCL: R26.1 U4.2(SCL/SPC) U5.29(IO36) U12.4(SDI) U13.6 U17.4(SCL/SPS)
D41SDA: R31.1 U4.4(SDA/SDI/SDO) U5.30(IO37) U12.2(SCK) U13.5 U17.6(SDA/SDI/SDO)
D46PIRO2: R6.2 U5.17(IO9)
D47: SERVO3.2 U5.24(IO47)
D48: SERVO3.3 U5.25(IO48)
D+: U5.14(IO20) USBC1.A6(DP1) USBC1.B6(DP2)
D-: U5.13(IO19) USBC1.A7(DN1) USBC1.B7(DN2)
EN: C14.1 R12.2 R14.1 U5.3(EN)
IO0: R11.2 U5.27(IO0) U13.7
MISO: CARD1.7(DAT0) U5.9(IO16) U15.7 U18.16(MISO)
MOSI: CARD1.8(DAT1) U5.8(IO15) U15.6 U18.17(MOSI)
PIRO1-: Q10.3(D) U13.1
PIRO2-: Q9.3(D) U13.2
PIRO3-: Q8.3(D) U13.3
PIRO4-: Q7.3(D) U13.4
PPS: U5.31(IO38) U6.1(PPS)
RX: U5.36(RXD0) U6.2(TXD)
TX: U5.37(TXD0) U6.3(RXD)
V: R34.2 R35.1 U5.39(IO1)
$1N5: C15.2 EN1.2 R12.1
$1N13: R21.1 U2.7(EN)
$1N14: C1.1 U2.8(SS)
$1N15: C2.1 U2.6(COMP)
$1N16: C6.2 D1.1(K) L2.1 U2.3(SW)
$1N18: R24.2 R30.1 U2.5(FB)
$1N20: C6.1 U2.1(BS)
$1N1285: C2.2 R23.1
$1N7934: C25.2 R32.1
$1N12300: U18.7(TXEN) U18.8(DIO2)
$1N13611: R36.2 U5.26(IO45)
$1N13616: R37.1 U5.16(IO46)
$1N14866: R13.1 USBC1.A5(CC1)
$1N14869: R38.2 USBC1.B5(CC2)
$2N1: Q7.1(G) R1.2 R2.1
$2N2: Q8.1(G) R3.2 R4.1
$2N3: Q9.1(G) R5.2 R6.1
$2N4: Q10.1(G) R7.1 R8.2
$2N19: C17.1 U4.1(VDDIO) U4.3(VDDIO)
$2N22: C20.2 U4.24(C1)
$2N907: LED1.4(DIN) R10.1
$2N956: LED2.1(A) R20.1
$2N973: C22.1 U4.21(CAP)
$2N3959: BUZZER1.2 BUZZER1.4 Q11.3(D)
$2N14318: Q11.1(G) R9.1 R33.1

Not connected (* = marked no-connect by the designer): CARD1 1(DAT2)* 3(CMD)* CD*; LED1 2(DOUT)*; U4 9(DRDY_M)* 10(INT_M)* 11(NT1_A/G)* 12(INT2_A/G)* 13(DEN_A/G)*; U5 32(IO39)* 33(IO40)* 34(IO41)* 35(IO42)* 38(IO2)*; U12 7(INT)*; U16 4(TAB)*; U17 2(NC)* 3(NC)* 9(INT2)* 11(INT1)*; U18 1(GND) 2(GND) 3(GND) 4(GND) 13(DIO1)* 21(ANT)*; USBC1 A4(VBUS)* A8(SBU1)* A9(VBUS)* B4(VBUS)* B8(SBU2)* B9(VBUS)*

## Notes on the sheets
sheet 1
- LORA
- I2C_PULLUP
- RST_BUTTON
- power
- SDCARD
- 3.3volts
- ESP32-s3
- usb-c
- 5volts
sheet 2
- VA_out
- IMU
- GPS
- OUTPUTS
- BMP
